# Altium schematic sheet digital_signal_8_in.SchDoc
size A4
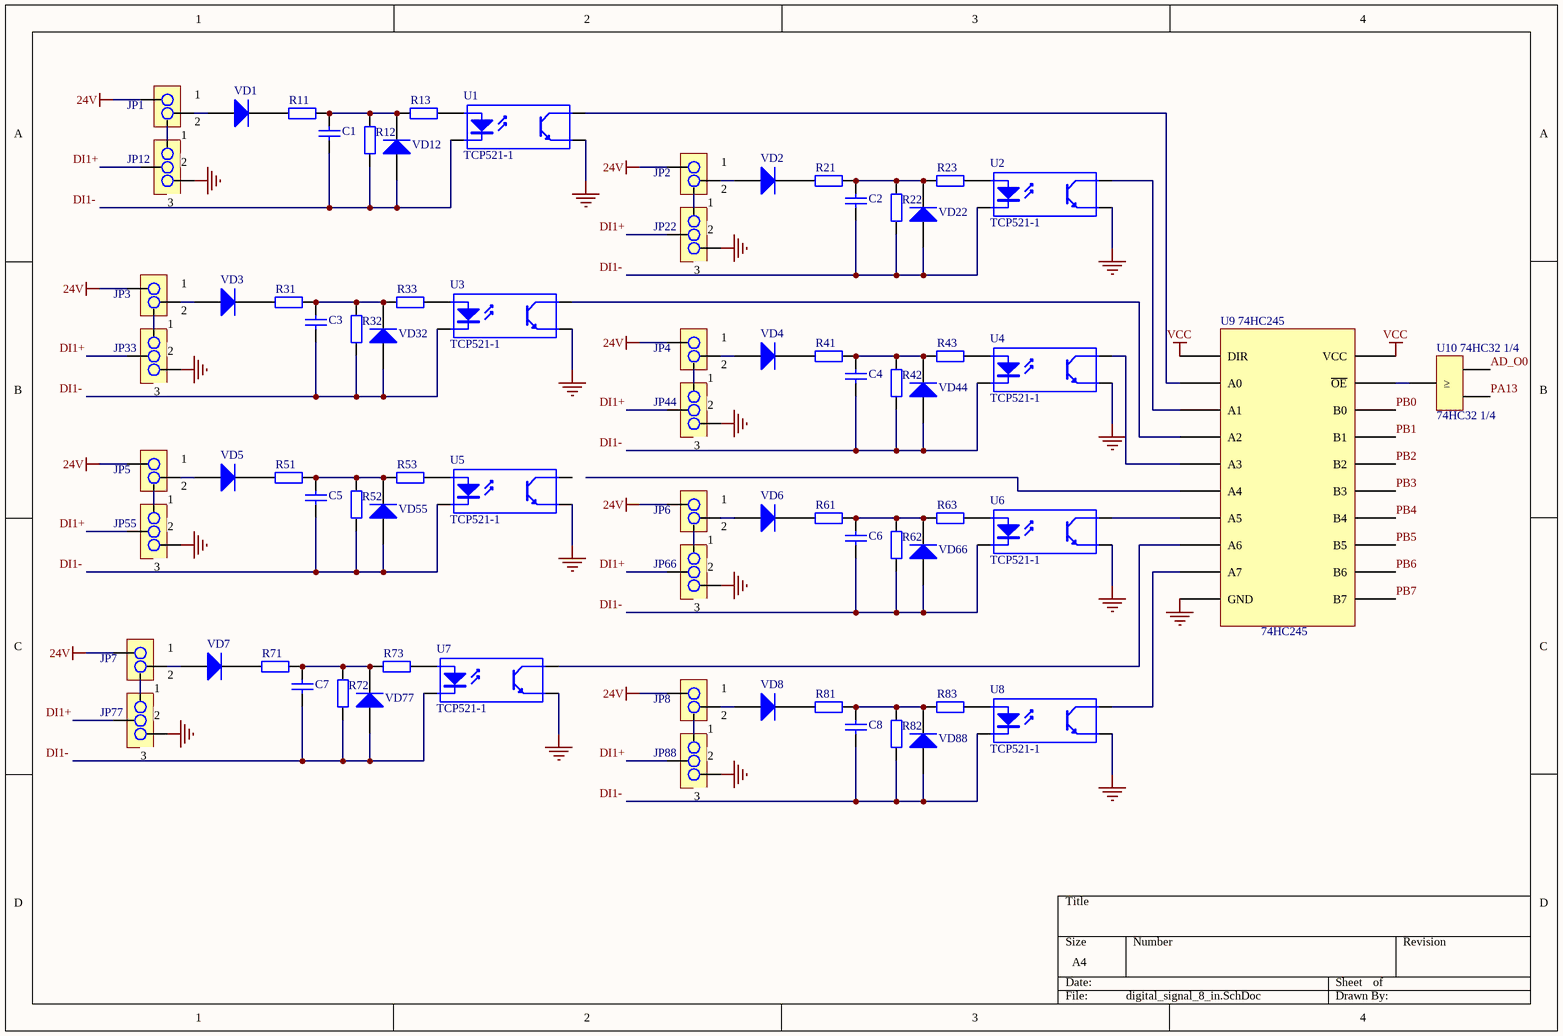
[diagram p0: digital_signal_8_in.SchDoc]

## Parts
C1  (no value)  [RAD-0.3]
C2  (no value)  [RAD-0.3]
C3  (no value)  [RAD-0.3]
C4  (no value)  [RAD-0.3]
C5  (no value)  [RAD-0.3]
C6  (no value)  [RAD-0.3]
C7  (no value)  [RAD-0.3]
C8  (no value)  [RAD-0.3]
JP1  (no value)
JP2  (no value)
JP3  (no value)
JP4  (no value)
JP5  (no value)
JP6  (no value)
JP7  (no value)
JP8  (no value)
JP12  (no value)
JP22  (no value)
JP33  (no value)
JP44  (no value)
JP55  (no value)
JP66  (no value)
JP77  (no value)
JP88  (no value)
R11  Res2  [AXIAL-0.4]  (value not drawn)
R12  (no value)  [AXIAL-0.4]
R13  (no value)  [AXIAL-0.4]
R21  Res2  [AXIAL-0.4]  (value not drawn)
R22  (no value)  [AXIAL-0.4]
R23  (no value)  [AXIAL-0.4]
R31  Res2  [AXIAL-0.4]  (value not drawn)
R32  (no value)  [AXIAL-0.4]
R33  (no value)  [AXIAL-0.4]
R41  Res2  [AXIAL-0.4]  (value not drawn)
R42  (no value)  [AXIAL-0.4]
R43  (no value)  [AXIAL-0.4]
R51  Res2  [AXIAL-0.4]  (value not drawn)
R52  (no value)  [AXIAL-0.4]
R53  (no value)  [AXIAL-0.4]
R61  Res2  [AXIAL-0.4]  (value not drawn)
R62  (no value)  [AXIAL-0.4]
R63  (no value)  [AXIAL-0.4]
R71  Res2  [AXIAL-0.4]  (value not drawn)
R72  (no value)  [AXIAL-0.4]
R73  (no value)  [AXIAL-0.4]
R81  Res2  [AXIAL-0.4]  (value not drawn)
R82  (no value)  [AXIAL-0.4]
R83  (no value)  [AXIAL-0.4]
U1  TCP521-1  [DIP-4]
U2  TCP521-1  [DIP-4]
U3  TCP521-1  [DIP-4]
U4  TCP521-1  [DIP-4]
U5  TCP521-1  [DIP-4]
U6  TCP521-1  [DIP-4]
U7  TCP521-1  [DIP-4]
U8  TCP521-1  [DIP-4]
U9_74HC245  74HC245
U10_74HC32_1/4  74HC32 1/4
VD1  Diode  [SMC]  (value not drawn)
VD2  Diode  [SMC]  (value not drawn)
VD3  Diode  [SMC]  (value not drawn)
VD4  Diode  [SMC]  (value not drawn)
VD5  Diode  [SMC]  (value not drawn)
VD6  Diode  [SMC]  (value not drawn)
VD7  Diode  [SMC]  (value not drawn)
VD8  Diode  [SMC]  (value not drawn)
VD12  Diode  [SMC]  (value not drawn)
VD22  Diode  [SMC]  (value not drawn)
VD32  Diode  [SMC]  (value not drawn)
VD44  Diode  [SMC]  (value not drawn)
VD55  Diode  [SMC]  (value not drawn)
VD66  Diode  [SMC]  (value not drawn)
VD77  Diode  [SMC]  (value not drawn)
VD88  Diode  [SMC]  (value not drawn)

## Nets
24V: JP1.?1 JP2.?1 JP3.?1 JP4.?1 JP5.?1 JP6.?1 JP7.?1 JP8.?1
NetJP12_?1: JP12.?1 JP22.?1 JP33.?1 JP44.?1 JP55.?1 JP66.?1 JP77.?1 JP88.?1 U1.3(E) U2.3(E) U3.3(E) U4.3(E) U5.3(E) U6.3(E) U7.3(E) U8.3(E) U9_74HC245.?19(GND)
VCC: U9_74HC245.?1(VCC) U9_74HC245.?20(DIR)
AD_O0: U10_74HC32_1/4.?1
PA13: U10_74HC32_1/4.?3
PB0: U9_74HC245.?3(B0)
PB1: U9_74HC245.?4(B1)
PB2: U9_74HC245.?5(B2)
PB3: U9_74HC245.?6(B3)
PB4: U9_74HC245.?7(B4)
PB5: U9_74HC245.?8(B5)
PB6: U9_74HC245.?9(B6)
PB7: U9_74HC245.?10(B7)
NetC1_1: C1.1 R12.1 U1.2(K) VD12.1(A)
NetC1_2: C1.2 R11.2 R12.2 R13.1 VD12.2(K)
NetC2_1: C2.1 R22.1 U2.2(K) VD22.1(A)
NetC2_2: C2.2 R21.2 R22.2 R23.1 VD22.2(K)
NetC3_1: C3.1 R32.1 U3.2(K) VD32.1(A)
NetC3_2: C3.2 R31.2 R32.2 R33.1 VD32.2(K)
NetC4_1: C4.1 R42.1 U4.2(K) VD44.1(A)
NetC4_2: C4.2 R41.2 R42.2 R43.1 VD44.2(K)
NetC5_1: C5.1 R52.1 U5.2(K) VD55.1(A)
NetC5_2: C5.2 R51.2 R52.2 R53.1 VD55.2(K)
NetC6_1: C6.1 R62.1 U6.2(K) VD66.1(A)
NetC6_2: C6.2 R61.2 R62.2 R63.1 VD66.2(K)
NetC7_1: C7.1 R72.1 U7.2(K) VD77.1(A)
NetC7_2: C7.2 R71.2 R72.2 R73.1 VD77.2(K)
NetC8_1: C8.1 R82.1 U8.2(K) VD88.1(A)
NetC8_2: C8.2 R81.2 R82.2 R83.1 VD88.2(K)
NetJP1_?2: JP1.?2 VD1.1(A)
NetJP1_?3: JP1.?3 JP12.?3
NetJP2_?2: JP2.?2 VD2.1(A)
NetJP2_?3: JP2.?3 JP22.?3
NetJP3_?2: JP3.?2 VD3.1(A)
NetJP3_?3: JP3.?3 JP33.?3
NetJP4_?2: JP4.?2 VD4.1(A)
NetJP4_?3: JP4.?3 JP44.?3
NetJP5_?2: JP5.?2 VD5.1(A)
NetJP5_?3: JP5.?3 JP55.?3
NetJP6_?2: JP6.?2 VD6.1(A)
NetJP6_?3: JP6.?3 JP66.?3
NetJP7_?2: JP7.?2 VD7.1(A)
NetJP7_?3: JP7.?3 JP77.?3
NetJP8_?2: JP8.?2 VD8.1(A)
NetJP8_?3: JP8.?3 JP88.?3
NetR11_1: R11.1 VD1.2(K)
NetR13_2: R13.2 U1.1(A)
NetR21_1: R21.1 VD2.2(K)
NetR23_2: R23.2 U2.1(A)
NetR31_1: R31.1 VD3.2(K)
NetR33_2: R33.2 U3.1(A)
NetR41_1: R41.1 VD4.2(K)
NetR43_2: R43.2 U4.1(A)
NetR51_1: R51.1 VD5.2(K)
NetR53_2: R53.2 U5.1(A)
NetR61_1: R61.1 VD6.2(K)
NetR63_2: R63.2 U6.1(A)
NetR71_1: R71.1 VD7.2(K)
NetR73_2: R73.2 U7.1(A)
NetR81_1: R81.1 VD8.2(K)
NetR83_2: R83.2 U8.1(A)
NetU1_4: U1.4(C) U9_74HC245.?11(A0)
NetU2_4: U2.4(C) U9_74HC245.?12(A1)
NetU3_4: U3.4(C) U9_74HC245.?13(A2)
NetU4_4: U4.4(C) U9_74HC245.?14(A3)
NetU6_4: U6.4(C) U9_74HC245.?16(A5)
NetU7_4: U7.4(C) U9_74HC245.?17(A6)
NetU8_4: U8.4(C) U9_74HC245.?18(A7)
NetU9_74HC245_?2: U9_74HC245.?2(~{OE}) U10_74HC32_1/4.?2(≥)

Not connected (* = marked no-connect by the designer): JP12 ?2; JP22 ?2; JP33 ?2; JP44 ?2; JP55 ?2; JP66 ?2; JP77 ?2; JP88 ?2; U5 4(C); U9_74HC245 ?15(A4)

## Notes on the sheet
- Labels drawn without touching a wire or pin: DI1+, DI1-
- (in symbol JP1) 1 /; 2 /
- (in symbol JP2) 1 /; 2 /; Text; 3 /

## Library data of the parts
C1-C8 = Cap: Capacitor; Value: 100pF; Published: 8-Jun-2000; LatestRevisionDate: 17-Jul-2002; LatestRevisionNote: Re-released for DXP Platform.; PackageReference: RAD-0.3; Publisher: Altium Limited; PackageDescription: Radial Cap, Thru-Hole; 2 Leads; 0.3 in Pin Spacing
JP1-JP8 = JP1
JP12 JP22 JP33 JP44 JP55 JP66 JP77 JP88 = JP2
R11 R12 R21 R22 R31 R32 R41 R42 R51 R52 R61 R62 R71 R72 R81 R82 = Res2: Resistor; Value: 1K; Published: 8-Jun-2000; LatestRevisionDate: 17-Jul-2002; LatestRevisionNote: Re-released for DXP Platform.; PackageReference: AXIAL-0.4; Publisher: Altium Limited; PackageDescription: Axial Device, Thru-Hole; 2 Leads; 0.4 in Pin Spacing
R13 R23 R33 R43 R53 R63 R73 R83 = Res2: Resistor; Published: 8-Jun-2000; LatestRevisionDate: 17-Jul-2002; LatestRevisionNote: Re-released for DXP Platform.; PackageReference: AXIAL-0.4; Publisher: Altium Limited; PackageDescription: Axial Device, Thru-Hole; 2 Leads; 0.4 in Pin Spacing
U1-U8 = Optoisolator1: 4-Pin Phototransistor Optocoupler; Published: 24-Mar-1999; LatestRevisionDate: 04-Mar-2005; LatestRevisionNote: Sch pins 3 & 4 Swapped.; DatasheetVersion: Nov-2003; PackageReference: DIP-4; Publisher: Altium Limited
VD1-VD8 VD12 VD22 VD32 VD44 VD55 VD66 VD77 VD88 = Diode: Default Diode; Published: 8-Jun-2000; LatestRevisionDate: 17-Jul-2002; LatestRevisionNote: Re-released for DXP Platform.; PackageVersion: Sep-1996; PackageReference: SMC; Publisher: Altium Limited; PackageDescription: DO-214-AB/SMC; 2 C-Bend Leads; Body 7.9 x 5.9 mm, inc. leads (LxW); Code_JEDEC: DO-214-AB